# EasyEDA Pro project Twinverter_PB_MTE_3.eprj, schematic pl203_continous
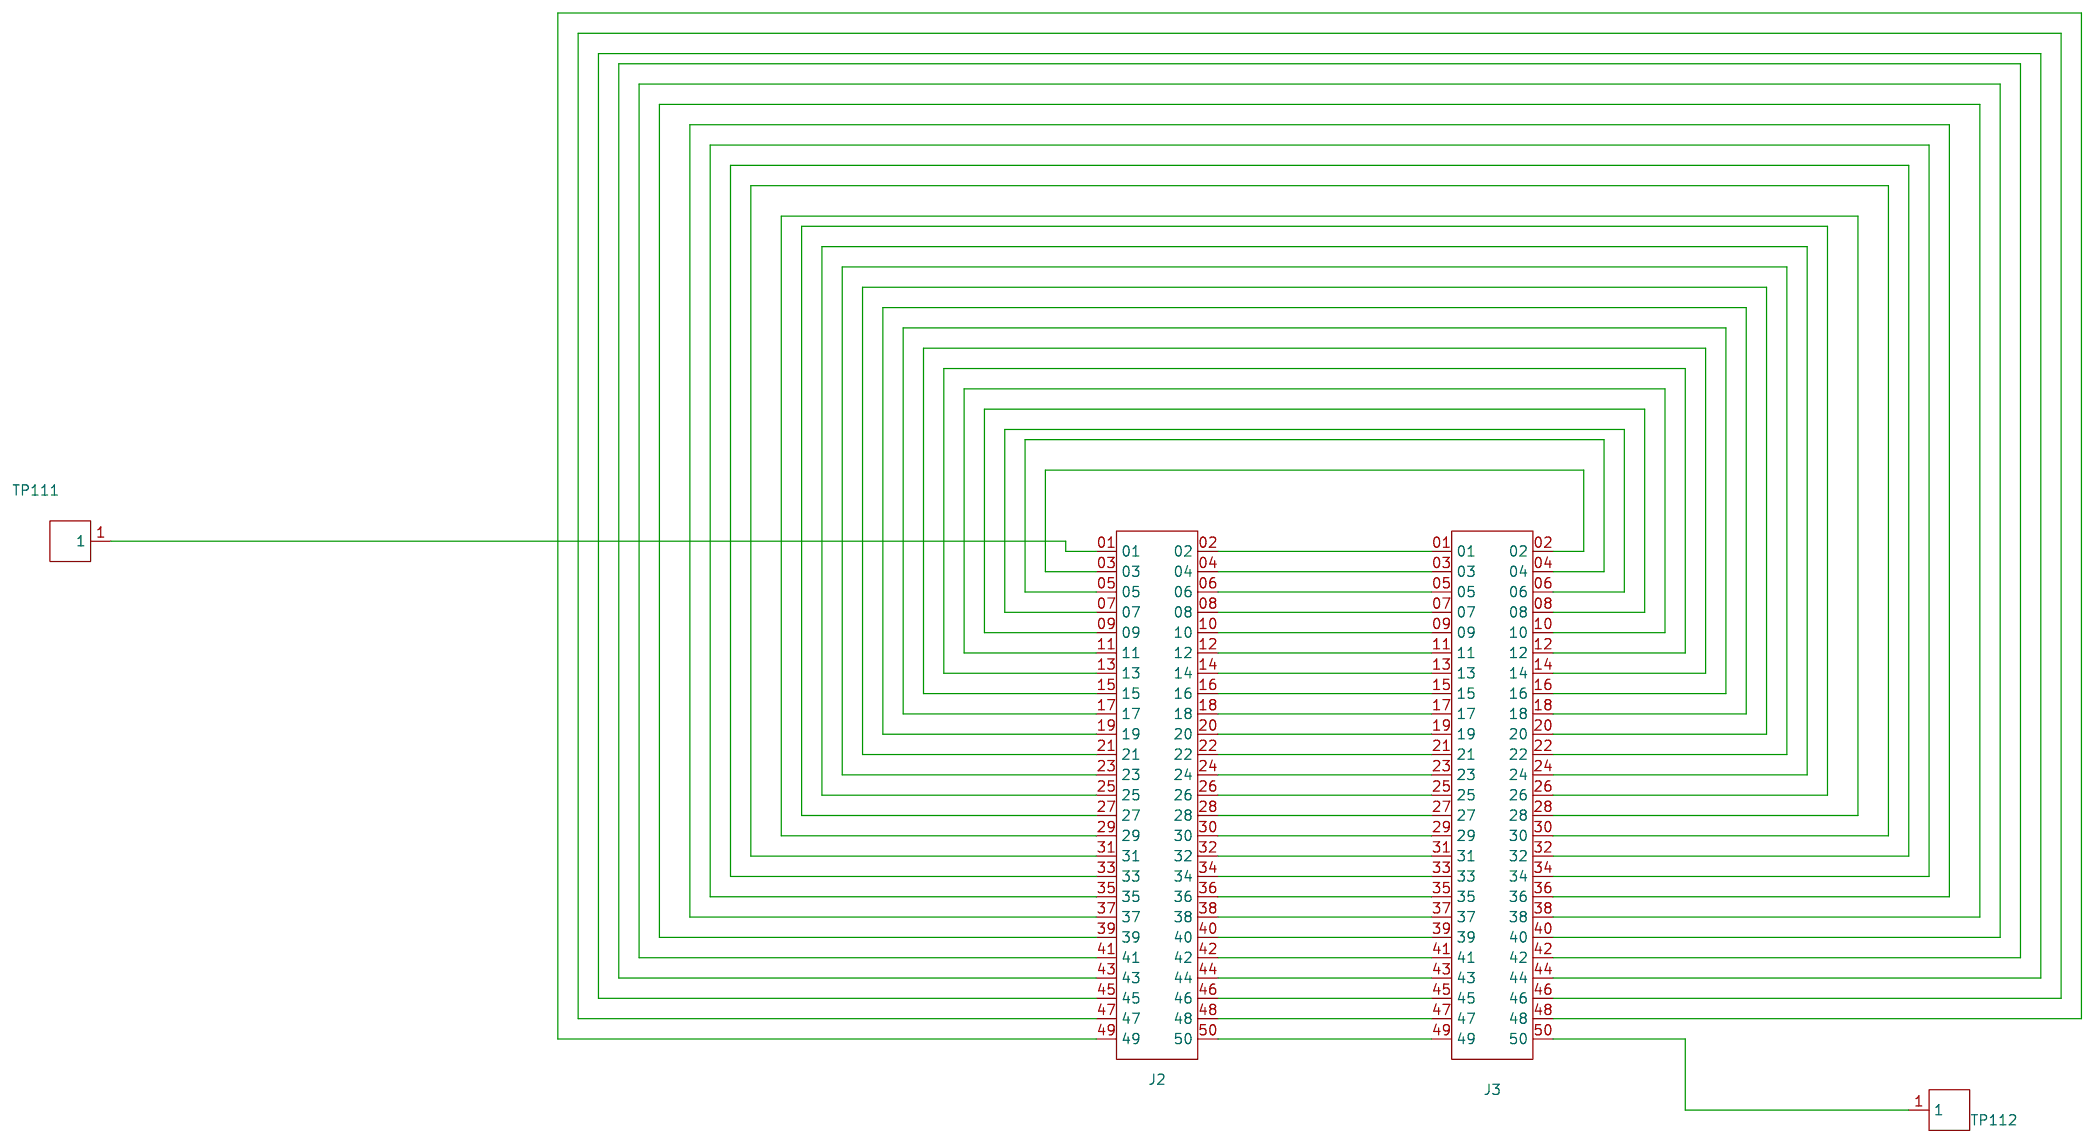
[diagram p3: schematic sheet]

## Parts
J2  TFML-125-02-S-D-A  [CONN-SMD_50P-TFML-125-02-S-D-A]
J3  TFML-125-02-S-D-A  [CONN-SMD_50P-TFML-125-02-S-D-A]
TP111  RH-5015  [SMD_RH-5015]
TP112  RH-5015  [SMD_RH-5015]

## Library data of the parts
J2 J3 = TFML-125-01-S-D-RA: Supplier Part: C17503084; Manufacturer: SAMTEC; Supplier Footprint: 插件; JLCPCB Part Class: Extended Part; Datasheet: https://atta.szlcsc.com/upload/public/pdf/source/231023/C17200826-8fd860b376dc57f4b81139fe7e44d820.pdf; Supplier: LCSC
TP111 TP112 = RH-5015: LCSC Part Name: PCB电路板测试点/测试针; Supplier Part: C5199798; Manufacturer: 荣和; JLCPCB Part Class: Extended Part; Datasheet: https://atta.szlcsc.com/upload/public/pdf/source/20231026/DF0E995FBD7BB891A195515CC364B170.pdf; Supplier: LCSC; Connector Type: 铁环型(贴片); Plastic Color: 无塑胶; Board Space (Diameter φ/ Length x Width): 2.67mmx1.02mm

## Nets
Net-(J2-01): J2.01 TP111.1
Net-(J2-02): J2.02 J3.01
Net-(J2-03): J2.03 J3.02
Net-(J2-04): J2.04 J3.03
Net-(J2-05): J2.05 J3.04
Net-(J2-06): J2.06 J3.05
Net-(J2-07): J2.07 J3.06
Net-(J2-08): J2.08 J3.07
Net-(J2-09): J2.09 J3.08
Net-(J2-10): J2.10 J3.09
Net-(J2-11): J2.11 J3.10
Net-(J2-12): J2.12 J3.11
Net-(J2-13): J2.13 J3.12
Net-(J2-14): J2.14 J3.13
Net-(J2-15): J2.15 J3.14
Net-(J2-16): J2.16 J3.15
Net-(J2-17): J2.17 J3.16
Net-(J2-18): J2.18 J3.17
Net-(J2-19): J2.19 J3.18
Net-(J2-20): J2.20 J3.19
Net-(J2-21): J2.21 J3.20
Net-(J2-22): J2.22 J3.21
Net-(J2-23): J2.23 J3.22
Net-(J2-24): J2.24 J3.23
Net-(J2-25): J2.25 J3.24
Net-(J2-26): J2.26 J3.25
Net-(J2-27): J2.27 J3.26
Net-(J2-28): J2.28 J3.27
Net-(J2-29): J2.29 J3.28
Net-(J2-30): J2.30 J3.29
Net-(J2-31): J2.31 J3.30
Net-(J2-32): J2.32 J3.31
Net-(J2-33): J2.33 J3.32
Net-(J2-34): J2.34 J3.33
Net-(J2-35): J2.35 J3.34
Net-(J2-36): J2.36 J3.35
Net-(J2-37): J2.37 J3.36
Net-(J2-38): J2.38 J3.37
Net-(J2-39): J2.39 J3.38
Net-(J2-40): J2.40 J3.39
Net-(J2-41): J2.41 J3.40
Net-(J2-42): J2.42 J3.41
Net-(J2-43): J2.43 J3.42
Net-(J2-44): J2.44 J3.43
Net-(J2-45): J2.45 J3.44
Net-(J2-46): J2.46 J3.45
Net-(J2-47): J2.47 J3.46
Net-(J2-48): J2.48 J3.47
Net-(J2-49): J2.49 J3.48
Net-(J2-50): J2.50 J3.49
Net-(J3-50): J3.50 TP112.1
